# Altium schematic sheet deneme_yedek.SchDoc
size A4; SheetNumber: 1; SheetTotal: 1
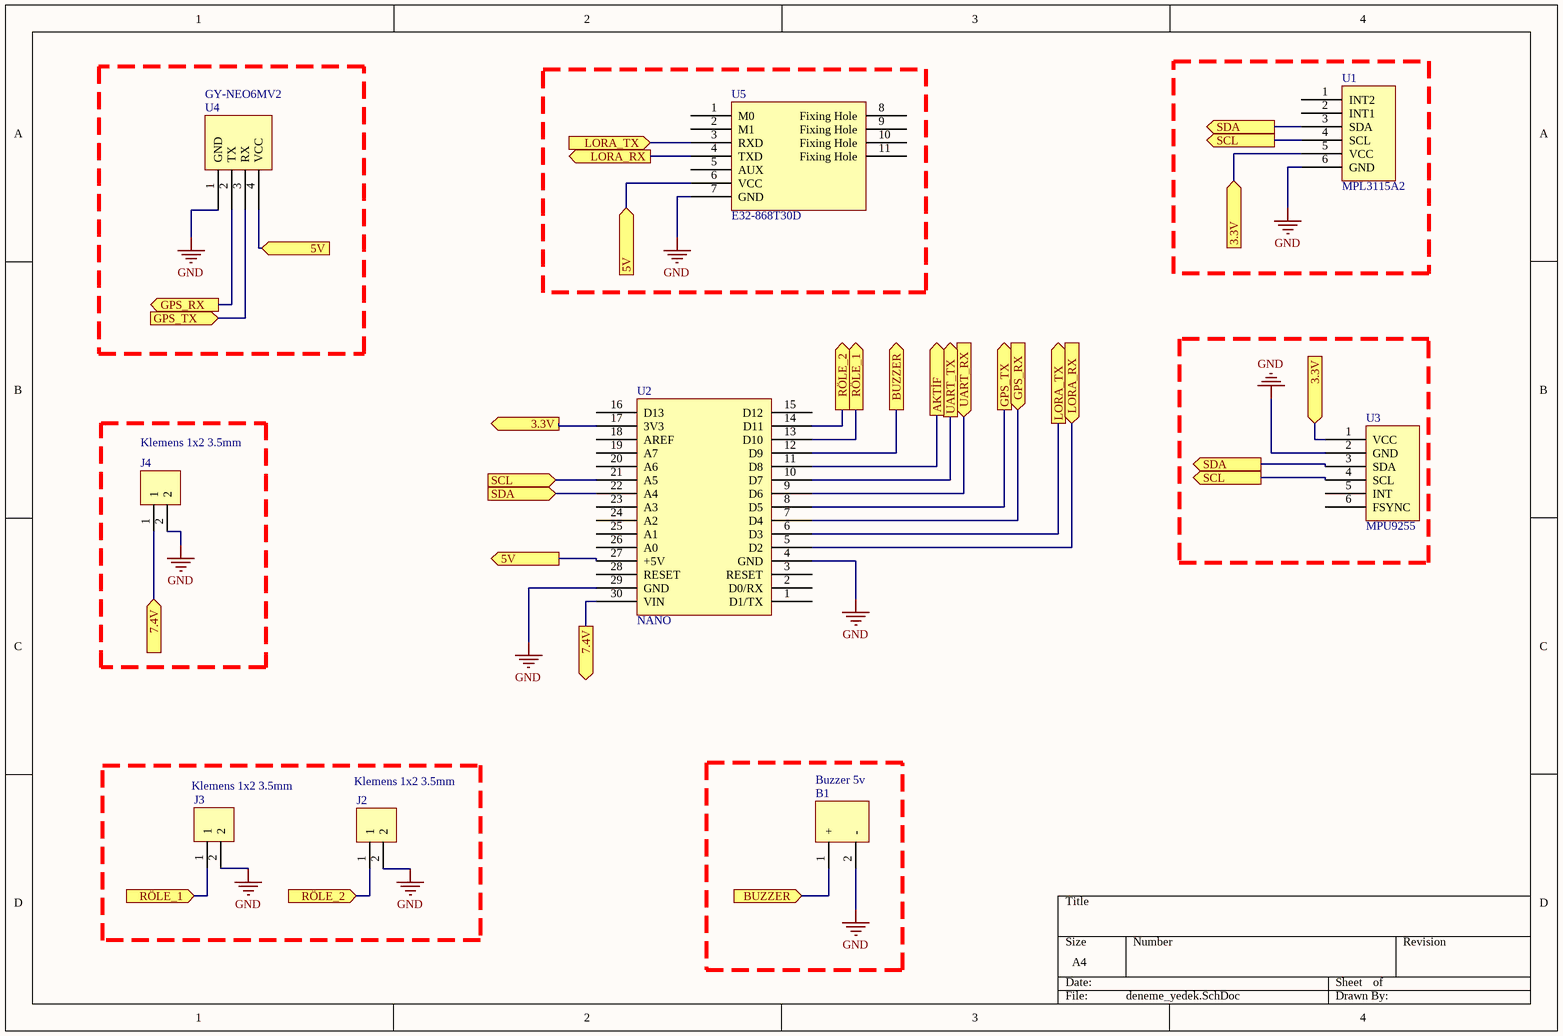
[diagram p0: deneme_yedek.SchDoc]

## Parts
B1  Buzzer 5v  [Buzzer 5v]
J2  Klemens 1x2 3.5mm  [Klemens 1x2 - 3.5mm]
J3  Klemens 1x2 3.5mm  [Klemens 1x2 - 3.5mm]
J4  Klemens 1x2 3.5mm  [Klemens 1x2 - 3.5mm]
U1  MPL3115A2  [MPL3115A2]
U2  NANO  [nano]
U3  MPU9255  [MPU9255]
U4  GY-NEO6MV2  [GY-NEO6MV2]
U5  E32-868T30D  [E32-868T30D]

## Ports
3.3V (in), 3.3V (out), 5V (in), 5V (out), 7.4V (in), 7.4V (out), AKTİF (out), BUZZER (in), BUZZER (out), GPS_RX (in), GPS_RX (out), GPS_TX (in), GPS_TX (out), LORA_RX (in), LORA_RX (out), LORA_TX (in), LORA_TX (out), RÖLE_1 (in), RÖLE_1 (out), RÖLE_2 (in), RÖLE_2 (out), SCL (in), SCL (out), SDA (in), SDA (out), UART_RX (in), UART_TX (out)

## Nets
GND: B1.2(-) J2.2 J3.2 J4.2 U1.6(GND) U2.4(GND) U2.29(GND) U3.2(GND) U4.1(GND) U5.7(GND)
3.3V: U1.5(VCC) U2.17(3V3) U3.1(VCC) ; port 3.3V
5V: U2.27(+5V) U4.4(VCC) U5.6(VCC) ; port 5V
7.4V: J4.1 U2.30(VIN) ; port 7.4V
AKTİF: U2.11(D8) ; port AKTİF
BUZZER: B1.1(+) U2.12(D9) ; port BUZZER
GPS_RX: U2.7(D4) U4.2(TX) ; port GPS_RX
GPS_TX: U2.8(D5) U4.3(RX) ; port GPS_TX
LORA_RX: U2.5(D2) U5.4(TXD) ; port LORA_RX
LORA_TX: U2.6(D3) U5.3(RXD) ; port LORA_TX
RÖLE_1: J3.1 U2.13(D10) ; port RÖLE_1
RÖLE_2: J2.1 U2.14(D11) ; port RÖLE_2
SCL: U1.4(SCL) U2.21(A5) U3.4(SCL) ; port SCL
SDA: U1.3(SDA) U2.22(A4) U3.3(SDA) ; port SDA
UART_RX: U2.9(D6) ; port UART_RX
UART_TX: U2.10(D7) ; port UART_TX

Not connected (* = marked no-connect by the designer): U1 1(INT2) 2(INT1); U2 1(D1/TX) 2(D0/RX) 3(RESET) 15(D12) 16(D13) 18(AREF) 19(A7) 20(A6) 23(A3) 24(A2) 25(A1) 26(A0) 28(RESET); U3 5(INT) 6(FSYNC); U5 1(M0) 2(M1) 5(AUX) 8(Fixing_Hole) 9(Fixing_Hole) 10(Fixing_Hole) 11(Fixing_Hole)